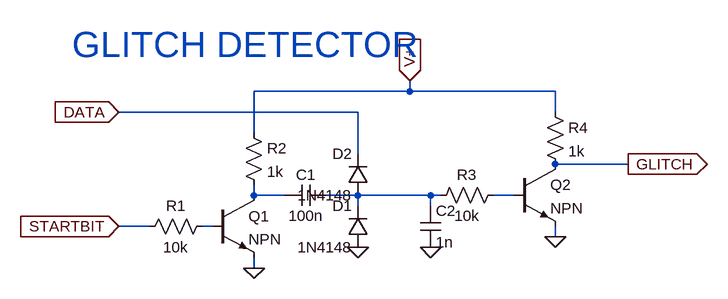
[diagram p0: schematic GlitchDetector.asc]
GlitchDetector.asc, the LTspice schematic file:
Version 4
SHEET 1 880 680
WIRE 256 -112 256 -128
WIRE 256 -112 16 -112
WIRE 480 -112 256 -112
WIRE 176 -80 -192 -80
WIRE 480 -80 480 -112
WIRE 16 -48 16 -112
WIRE 176 -16 176 -80
WIRE 592 0 480 0
WIRE 16 48 16 32
WIRE 64 48 16 48
WIRE 176 48 128 48
WIRE 288 48 176 48
WIRE 304 48 288 48
WIRE 416 48 384 48
WIRE 176 64 176 48
WIRE 288 64 288 48
WIRE -144 96 -192 96
WIRE -48 96 -64 96
WIRE 480 112 480 96
WIRE 16 160 16 144
FLAG 176 128 0
FLAG 480 112 0
FLAG 16 160 0
FLAG -192 96 STARTBIT
IOPIN -192 96 In
FLAG 256 -128 V+
IOPIN 256 -128 In
FLAG 592 0 GLITCH
IOPIN 592 0 Out
FLAG -192 -80 DATA
IOPIN -192 -80 In
FLAG 288 128 0
SYMBOL cap 128 32 R90
WINDOW 0 0 32 VBottom 2
WINDOW 3 32 32 VTop 2
SYMATTR InstName C1
SYMATTR Value 100n
SYMBOL diode 192 128 R180
WINDOW 0 24 64 Left 2
WINDOW 3 24 0 Left 2
SYMATTR InstName D1
SYMATTR Value 1N4148
SYMBOL diode 192 48 R180
WINDOW 0 24 64 Left 2
WINDOW 3 24 0 Left 2
SYMATTR InstName D2
SYMATTR Value 1N4148
SYMBOL npn 416 0 R0
SYMATTR InstName Q2
SYMBOL res 288 64 R270
WINDOW 0 32 56 VTop 2
WINDOW 3 0 56 VBottom 2
SYMATTR InstName R3
SYMATTR Value 10k
SYMBOL res 464 -96 R0
SYMATTR InstName R4
SYMATTR Value 1k
SYMBOL npn -48 48 R0
SYMATTR InstName Q1
SYMBOL res -160 112 R270
WINDOW 0 32 56 VTop 2
WINDOW 3 0 56 VBottom 2
SYMATTR InstName R1
SYMATTR Value 10k
SYMBOL res 0 -64 R0
SYMATTR InstName R2
SYMATTR Value 1k
SYMBOL cap 272 64 R0
SYMATTR InstName C2
SYMATTR Value 1n
TEXT -264 -184 Left 5 ;GLITCH DETECTOR

The netlist it stands for:
* GlitchDetector.asc
C1 N002 N001 100n
D1 0 N002 1N4148
D2 N002 DATA 1N4148
Q2 GLITCH N003 0 0 NPN
R3 N002 N003 10k
R4 V+ GLITCH 1k
Q1 N001 N004 0 0 NPN
R1 STARTBIT N004 10k
R2 V+ N001 1k
C2 N002 0 1n
.model D D
.lib standard.dio
.model NPN NPN
.model PNP PNP
.lib standard.bjt
* GLITCH DETECTOR
.backanno
.end